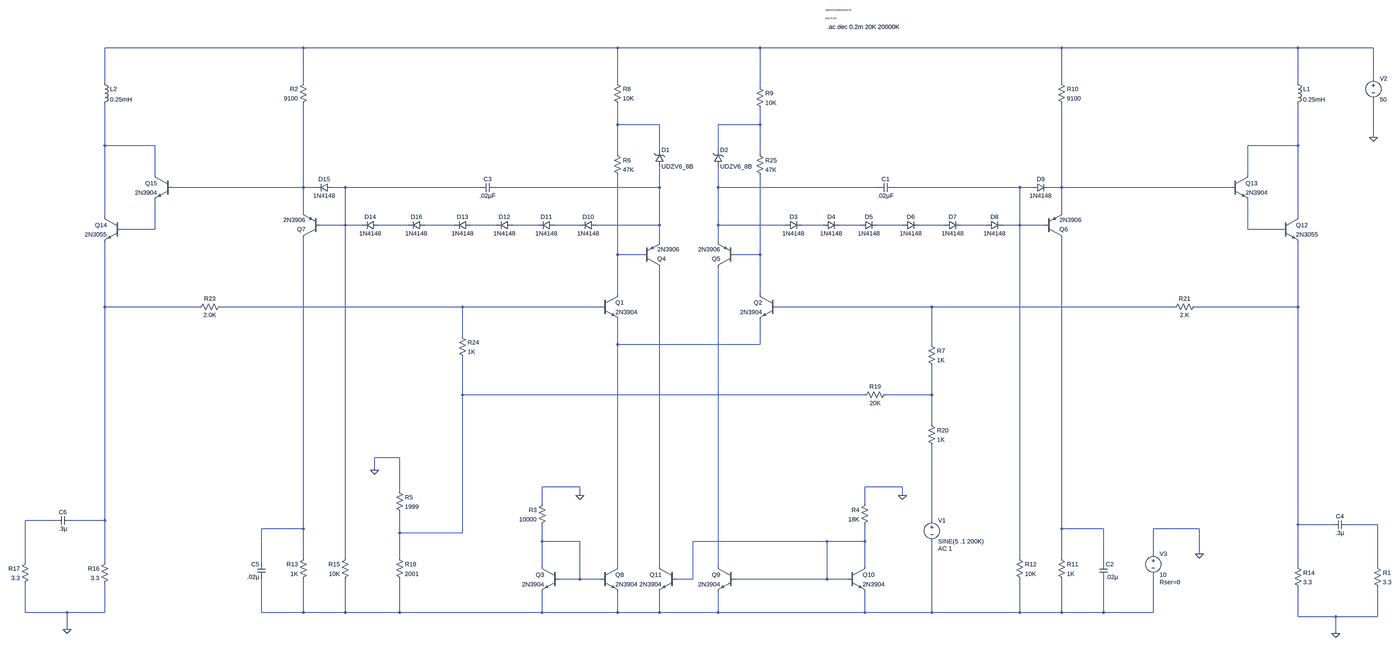
[diagram p0: schematic actestamp.asc, whole sheet]
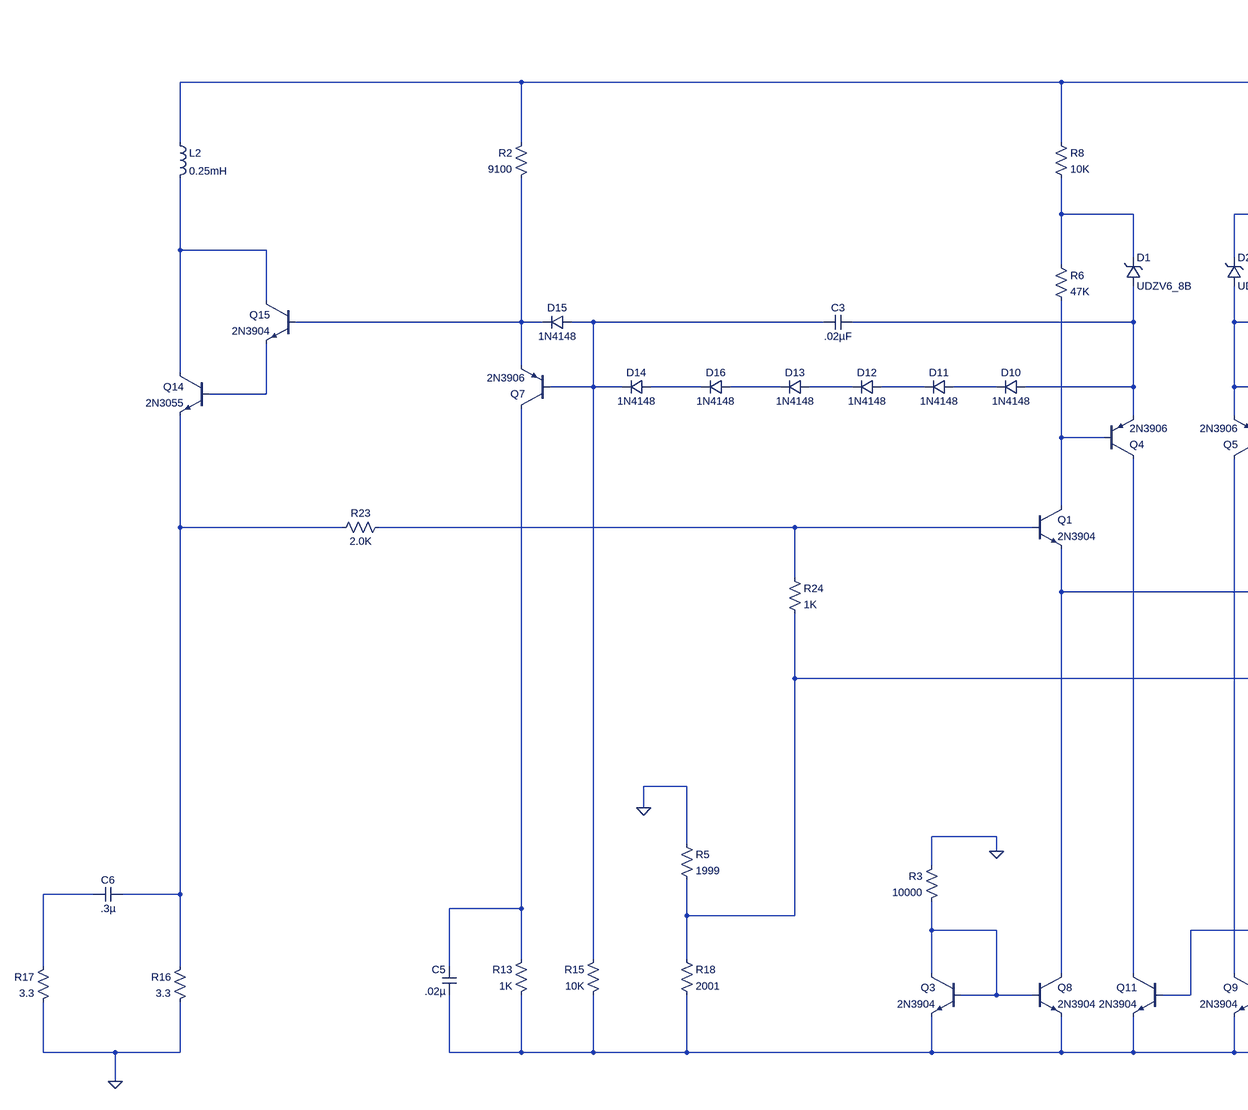
[diagram p1: schematic actestamp.asc, part, row 1 of 1, column 1 of 2]
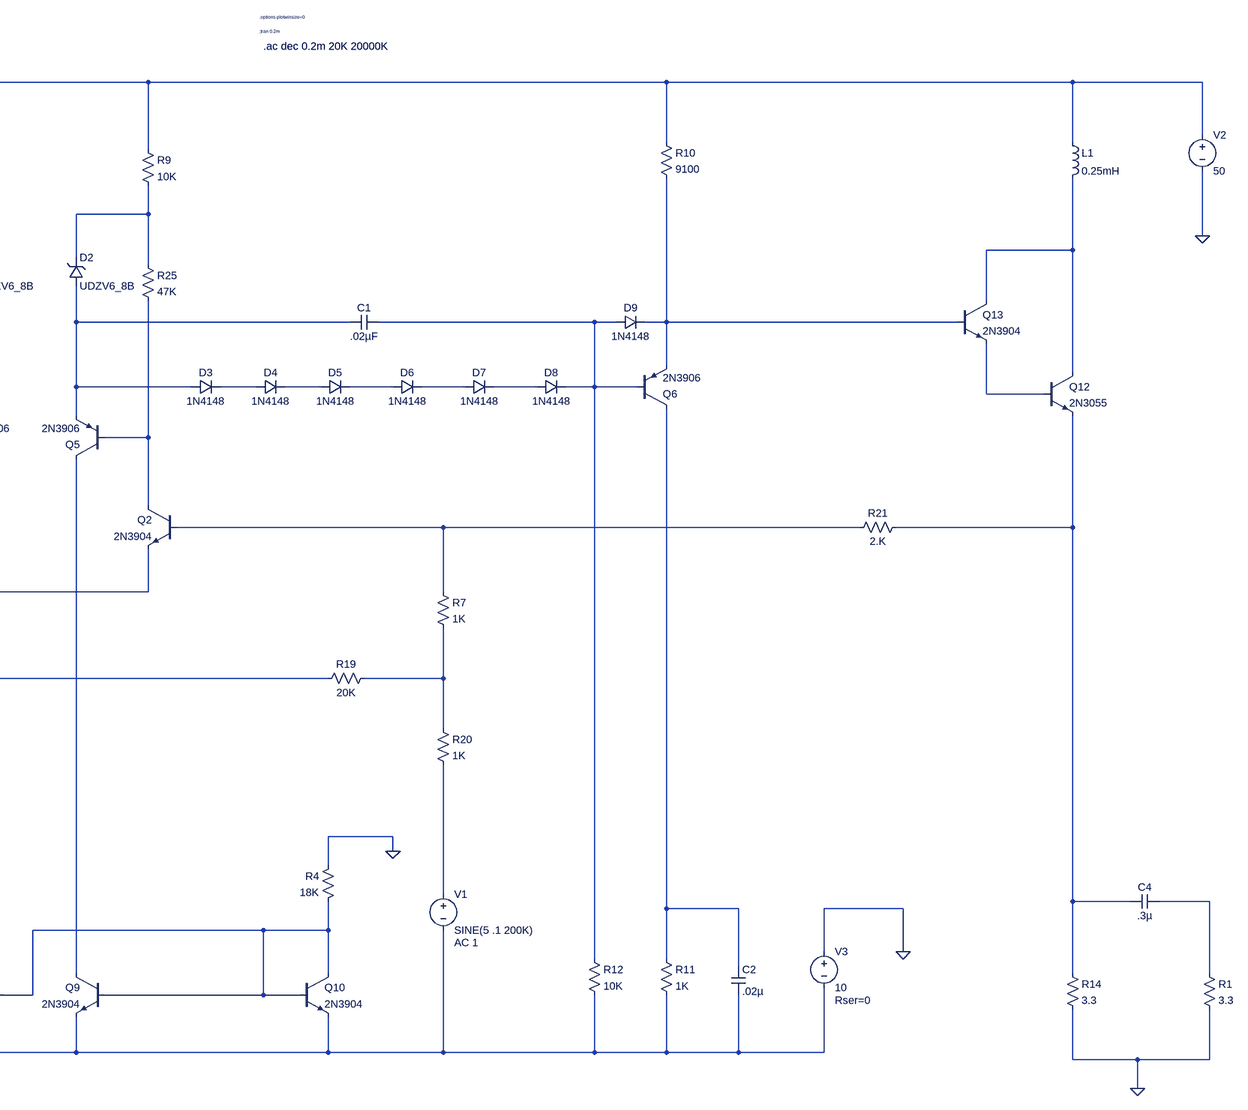
[diagram p2: schematic actestamp.asc, part, row 1 of 1, column 2 of 2]
actestamp.asc, the LTspice schematic file:
Version 4
SHEET 1 2560 2244
WIRE -1776 -1664 -2896 -1664
WIRE -576 -1664 -1776 -1664
WIRE -32 -1664 -576 -1664
WIRE 1120 -1664 -32 -1664
WIRE 2176 -1664 1120 -1664
WIRE 2464 -1664 2176 -1664
WIRE 2464 -1536 2464 -1664
WIRE -2896 -1520 -2896 -1664
WIRE -1776 -1520 -1776 -1664
WIRE -576 -1520 -576 -1664
WIRE 1120 -1520 1120 -1664
WIRE 2176 -1520 2176 -1664
WIRE -32 -1504 -32 -1664
WIRE -576 -1360 -576 -1440
WIRE -416 -1360 -576 -1360
WIRE -32 -1360 -32 -1424
WIRE -32 -1360 -192 -1360
WIRE 2464 -1312 2464 -1456
WIRE -2896 -1280 -2896 -1440
WIRE -2704 -1280 -2896 -1280
WIRE 2176 -1280 2176 -1440
WIRE 2176 -1280 1984 -1280
WIRE -416 -1264 -416 -1360
WIRE -192 -1264 -192 -1360
WIRE -576 -1248 -576 -1360
WIRE -32 -1248 -32 -1360
WIRE -2704 -1168 -2704 -1280
WIRE 1984 -1168 1984 -1280
WIRE -1776 -1120 -1776 -1440
WIRE -1776 -1120 -2640 -1120
WIRE -1728 -1120 -1776 -1120
WIRE -1616 -1120 -1664 -1120
WIRE -1104 -1120 -1616 -1120
WIRE -416 -1120 -416 -1200
WIRE -416 -1120 -1040 -1120
WIRE -192 -1120 -192 -1200
WIRE 416 -1120 -192 -1120
WIRE 960 -1120 480 -1120
WIRE 1008 -1120 960 -1120
WIRE 1120 -1120 1120 -1440
WIRE 1120 -1120 1072 -1120
WIRE 1920 -1120 1120 -1120
WIRE -1776 -1024 -1776 -1120
WIRE 1120 -1024 1120 -1120
WIRE -2896 -1008 -2896 -1280
WIRE 2176 -1008 2176 -1280
WIRE -1616 -976 -1616 -1120
WIRE -1616 -976 -1712 -976
WIRE -1552 -976 -1616 -976
WIRE -1376 -976 -1488 -976
WIRE -1200 -976 -1312 -976
WIRE -1040 -976 -1136 -976
WIRE -880 -976 -976 -976
WIRE -720 -976 -816 -976
WIRE -416 -976 -416 -1120
WIRE -416 -976 -656 -976
WIRE -192 -976 -192 -1120
WIRE 64 -976 -192 -976
WIRE 208 -976 128 -976
WIRE 352 -976 272 -976
WIRE 512 -976 416 -976
WIRE 672 -976 576 -976
WIRE 832 -976 736 -976
WIRE 960 -976 960 -1120
WIRE 960 -976 896 -976
WIRE 1056 -976 960 -976
WIRE -2704 -960 -2704 -1072
WIRE -2704 -960 -2832 -960
WIRE 1984 -960 1984 -1072
WIRE 2112 -960 1984 -960
WIRE -416 -912 -416 -976
WIRE -192 -912 -192 -976
WIRE -576 -864 -576 -1168
WIRE -480 -864 -576 -864
WIRE -32 -864 -32 -1168
WIRE -32 -864 -128 -864
WIRE -576 -592 -576 -864
WIRE -32 -592 -32 -864
WIRE -2896 -544 -2896 -912
WIRE -2528 -544 -2896 -544
WIRE -1168 -544 -2448 -544
WIRE -640 -544 -1168 -544
WIRE 624 -544 32 -544
WIRE 1680 -544 624 -544
WIRE 2176 -544 2176 -912
WIRE 2176 -544 1760 -544
WIRE -1168 -432 -1168 -544
WIRE -576 -400 -576 -496
WIRE -32 -400 -32 -496
WIRE -32 -400 -576 -400
WIRE 624 -400 624 -544
WIRE -1168 -208 -1168 -352
WIRE 368 -208 -1168 -208
WIRE 624 -208 624 -320
WIRE 624 -208 448 -208
WIRE 624 -96 624 -208
WIRE -1408 32 -1504 32
WIRE -1504 80 -1504 32
WIRE -720 144 -864 144
WIRE 512 144 368 144
WIRE -1408 160 -1408 32
WIRE -720 176 -720 144
WIRE 512 176 512 144
WIRE -864 208 -864 144
WIRE 368 208 368 144
WIRE -3088 272 -3200 272
WIRE -2896 272 -2896 -544
WIRE -2896 272 -3024 272
WIRE 624 272 624 -16
WIRE 2176 288 2176 -544
WIRE 2304 288 2176 288
WIRE 2480 288 2368 288
WIRE -1776 304 -1776 -928
WIRE -1776 304 -1936 304
WIRE 1120 304 1120 -928
WIRE 1280 304 1120 304
WIRE 1776 304 1600 304
WIRE -1408 320 -1408 240
WIRE -1168 320 -1168 -208
WIRE -1168 320 -1408 320
WIRE -864 352 -864 288
WIRE -720 352 -864 352
WIRE 224 352 -288 352
WIRE 368 352 368 288
WIRE 368 352 224 352
WIRE 1600 400 1600 304
WIRE 1776 400 1776 304
WIRE -1776 416 -1776 304
WIRE -1616 416 -1616 -976
WIRE -1408 416 -1408 320
WIRE 960 416 960 -976
WIRE 1120 416 1120 304
WIRE -3200 432 -3200 272
WIRE -2896 432 -2896 272
WIRE -1936 432 -1936 304
WIRE 1280 432 1280 304
WIRE -864 448 -864 352
WIRE -576 448 -576 -400
WIRE -416 448 -416 -816
WIRE -192 448 -192 -816
WIRE 368 448 368 352
WIRE 2176 448 2176 288
WIRE 2480 448 2480 288
WIRE -720 496 -720 352
WIRE -720 496 -800 496
WIRE -640 496 -720 496
WIRE -288 496 -288 352
WIRE -288 496 -352 496
WIRE 224 496 224 352
WIRE 224 496 -128 496
WIRE 304 496 224 496
WIRE -3200 624 -3200 512
WIRE -3040 624 -3200 624
WIRE -2896 624 -2896 512
WIRE -2896 624 -3040 624
WIRE -1936 624 -1936 496
WIRE -1776 624 -1776 496
WIRE -1776 624 -1936 624
WIRE -1616 624 -1616 496
WIRE -1616 624 -1776 624
WIRE -1408 624 -1408 496
WIRE -1408 624 -1616 624
WIRE -864 624 -864 544
WIRE -864 624 -1408 624
WIRE -576 624 -576 544
WIRE -576 624 -864 624
WIRE -416 624 -416 544
WIRE -416 624 -576 624
WIRE -192 624 -192 544
WIRE -192 624 -416 624
WIRE 368 624 368 544
WIRE 368 624 -192 624
WIRE 624 624 624 352
WIRE 624 624 368 624
WIRE 960 624 960 496
WIRE 960 624 624 624
WIRE 1120 624 1120 496
WIRE 1120 624 960 624
WIRE 1280 624 1280 496
WIRE 1280 624 1120 624
WIRE 1600 624 1600 480
WIRE 1600 624 1280 624
WIRE 2176 640 2176 528
WIRE 2320 640 2176 640
WIRE 2480 640 2480 528
WIRE 2480 640 2320 640
WIRE -3040 688 -3040 624
WIRE 2320 704 2320 640
FLAG 2320 704 0
FLAG 2464 -1312 0
FLAG -3040 688 0
FLAG 1776 400 0
FLAG -720 176 0
FLAG 512 176 0
FLAG -1504 80 0
DATAFLAG -576 -720 ""
DATAFLAG -32 -736 ""
DATAFLAG -928 -1120 ""
DATAFLAG 144 -1120 ""
DATAFLAG -1280 -1120 ""
DATAFLAG 672 -1120 ""
DATAFLAG -1008 624 ""
DATAFLAG 304 -1664 ""
DATAFLAG -128 -1296 ""
DATAFLAG -480 -1296 ""
DATAFLAG -224 -400 ""
DATAFLAG 176 -544 ""
DATAFLAG -912 -544 ""
DATAFLAG 1968 -544 ""
DATAFLAG -2720 -544 ""
DATAFLAG 1376 -1120 ""
DATAFLAG -2096 -1120 ""
DATAFLAG -480 -976 ""
SYMBOL npn -640 -592 R0
SYMATTR InstName Q1
SYMATTR Value 2N3904
SYMBOL npn 32 -592 M0
SYMATTR InstName Q2
SYMATTR Value 2N3904
SYMBOL pnp -480 -816 M180
SYMATTR InstName Q4
SYMATTR Value 2N3906
SYMBOL pnp -128 -816 R180
SYMATTR InstName Q5
SYMATTR Value 2N3906
SYMBOL res -592 -1264 R0
SYMATTR InstName R6
SYMATTR Value 47K
SYMBOL res 608 -416 R0
SYMATTR InstName R7
SYMATTR Value 1K
SYMBOL res -592 -1536 R0
SYMATTR InstName R8
SYMATTR Value 10K
SYMBOL res -48 -1520 R0
SYMATTR InstName R9
SYMATTR Value 10K
SYMBOL diode 64 -960 R270
WINDOW 0 32 32 VTop 2
WINDOW 3 0 32 VBottom 2
SYMATTR InstName D3
SYMATTR Value 1N4148
SYMBOL diode 208 -960 R270
WINDOW 0 32 32 VTop 2
WINDOW 3 0 32 VBottom 2
SYMATTR InstName D4
SYMATTR Value 1N4148
SYMBOL diode 352 -960 R270
WINDOW 0 32 32 VTop 2
WINDOW 3 0 32 VBottom 2
SYMATTR InstName D5
SYMATTR Value 1N4148
SYMBOL diode 512 -960 R270
WINDOW 0 32 32 VTop 2
WINDOW 3 0 32 VBottom 2
SYMATTR InstName D6
SYMATTR Value 1N4148
SYMBOL diode 672 -960 R270
WINDOW 0 32 32 VTop 2
WINDOW 3 0 32 VBottom 2
SYMATTR InstName D7
SYMATTR Value 1N4148
SYMBOL diode 832 -960 R270
WINDOW 0 32 32 VTop 2
WINDOW 3 0 32 VBottom 2
SYMATTR InstName D8
SYMATTR Value 1N4148
SYMBOL cap 480 -1136 R90
WINDOW 0 0 32 VBottom 2
WINDOW 3 32 32 VTop 2
SYMATTR InstName C1
SYMATTR Value .02µF
SYMBOL res 1104 -1536 R0
SYMATTR InstName R10
SYMATTR Value 9100
SYMBOL pnp 1056 -928 M180
SYMATTR InstName Q6
SYMATTR Value 2N3906
SYMBOL diode 1008 -1104 R270
WINDOW 0 32 32 VTop 2
WINDOW 3 0 32 VBottom 2
SYMATTR InstName D9
SYMATTR Value 1N4148
SYMBOL res 1104 400 R0
SYMATTR InstName R11
SYMATTR Value 1K
SYMBOL res 944 400 R0
SYMATTR InstName R12
SYMATTR Value 10K
SYMBOL cap 1264 432 R0
SYMATTR InstName C2
SYMATTR Value .02µ
SYMBOL res 2160 432 R0
SYMATTR InstName R14
SYMATTR Value 3.3
SYMBOL cap 2368 272 R90
WINDOW 0 0 32 VBottom 2
WINDOW 3 32 32 VTop 2
SYMATTR InstName C4
SYMATTR Value .3µ
SYMBOL res 2464 432 R0
SYMATTR InstName R1
SYMATTR Value 3.3
SYMBOL voltage 2464 -1552 R0
WINDOW 123 0 0 Left 2
WINDOW 39 0 0 Left 2
SYMATTR InstName V2
SYMATTR Value 50
SYMBOL diode -656 -960 M270
WINDOW 0 32 32 VTop 2
WINDOW 3 0 32 VBottom 2
SYMATTR InstName D10
SYMATTR Value 1N4148
SYMBOL diode -816 -960 M270
WINDOW 0 32 32 VTop 2
WINDOW 3 0 32 VBottom 2
SYMATTR InstName D11
SYMATTR Value 1N4148
SYMBOL diode -976 -960 M270
WINDOW 0 32 32 VTop 2
WINDOW 3 0 32 VBottom 2
SYMATTR InstName D12
SYMATTR Value 1N4148
SYMBOL diode -1136 -960 M270
WINDOW 0 32 32 VTop 2
WINDOW 3 0 32 VBottom 2
SYMATTR InstName D13
SYMATTR Value 1N4148
SYMBOL diode -1488 -960 M270
WINDOW 0 32 32 VTop 2
WINDOW 3 0 32 VBottom 2
SYMATTR InstName D14
SYMATTR Value 1N4148
SYMBOL cap -1104 -1136 M90
WINDOW 0 0 32 VBottom 2
WINDOW 3 32 32 VTop 2
SYMATTR InstName C3
SYMATTR Value .02µF
SYMBOL res -1760 -1536 M0
SYMATTR InstName R2
SYMATTR Value 9100
SYMBOL pnp -1712 -928 R180
SYMATTR InstName Q7
SYMATTR Value 2N3906
SYMBOL diode -1664 -1104 M270
WINDOW 0 32 32 VTop 2
WINDOW 3 0 32 VBottom 2
SYMATTR InstName D15
SYMATTR Value 1N4148
SYMBOL res -1760 400 M0
SYMATTR InstName R13
SYMATTR Value 1K
SYMBOL res -1600 400 M0
SYMATTR InstName R15
SYMATTR Value 10K
SYMBOL cap -1920 432 M0
SYMATTR InstName C5
SYMATTR Value .02µ
SYMBOL res -2880 416 M0
SYMATTR InstName R16
SYMATTR Value 3.3
SYMBOL cap -3088 256 M90
WINDOW 0 0 32 VBottom 2
WINDOW 3 32 32 VTop 2
SYMATTR InstName C6
SYMATTR Value .3µ
SYMBOL res -3184 416 M0
SYMATTR InstName R17
SYMATTR Value 3.3
SYMBOL res 1776 -560 R90
WINDOW 0 0 56 VBottom 2
WINDOW 3 32 56 VTop 2
SYMATTR InstName R21
SYMATTR Value 2.K
SYMBOL res -2432 -560 R90
WINDOW 0 0 56 VBottom 2
WINDOW 3 32 56 VTop 2
SYMATTR InstName R23
SYMATTR Value 2.0K
SYMBOL res -1184 -448 R0
SYMATTR InstName R24
SYMATTR Value 1K
SYMBOL res -48 -1264 R0
SYMATTR InstName R25
SYMATTR Value 47K
SYMBOL diode -1312 -960 M270
WINDOW 0 32 32 VTop 2
WINDOW 3 0 32 VBottom 2
SYMATTR InstName D16
SYMATTR Value 1N4148
SYMBOL zener -432 -1200 M180
WINDOW 0 24 64 Left 2
WINDOW 3 24 0 Left 2
SYMATTR InstName D1
SYMATTR Value UDZV6_8B
SYMBOL zener -208 -1200 M180
WINDOW 0 24 64 Left 2
WINDOW 3 24 0 Left 2
SYMATTR InstName D2
SYMATTR Value UDZV6_8B
SYMBOL voltage 1600 384 R0
WINDOW 123 0 0 Left 2
WINDOW 39 24 124 Left 2
SYMATTR SpiceLine Rser=0
SYMATTR InstName V3
SYMATTR Value 10
SYMBOL ind 2160 -1536 R0
SYMATTR InstName L1
SYMATTR Value 0.25mH
SYMATTR SpiceLine Ipk=1000 Rser=1 Rpar=680 Cpar=.00001uf
SYMBOL ind -2912 -1536 R0
SYMATTR InstName L2
SYMATTR Value 0.25mH
SYMATTR SpiceLine Ipk=1000 Rser=1 Rpar=680 Cpar=.00001uf
SYMBOL npn -800 448 M0
SYMATTR InstName Q3
SYMATTR Value 2N3904
SYMBOL npn -640 448 R0
SYMATTR InstName Q8
SYMATTR Value 2N3904
SYMBOL res -848 192 M0
SYMATTR InstName R3
SYMATTR Value 10000
SYMBOL npn -128 448 M0
SYMATTR InstName Q9
SYMATTR Value 2N3904
SYMBOL npn 304 448 R0
SYMATTR InstName Q10
SYMATTR Value 2N3904
SYMBOL res 384 192 M0
SYMATTR InstName R4
SYMATTR Value 18K
SYMBOL npn -352 448 M0
SYMATTR InstName Q11
SYMATTR Value 2N3904
SYMBOL res -1424 144 R0
SYMATTR InstName R5
SYMATTR Value 1999
SYMBOL res -1424 400 R0
SYMATTR InstName R18
SYMATTR Value 2001
SYMBOL res 464 -224 R90
WINDOW 0 0 56 VBottom 2
WINDOW 3 32 56 VTop 2
SYMATTR InstName R19
SYMATTR Value 20K
SYMBOL res 608 -112 R0
SYMATTR InstName R20
SYMATTR Value 1K
SYMBOL voltage 624 256 R0
WINDOW 123 24 124 Left 2
WINDOW 39 0 0 Left 2
SYMATTR InstName V1
SYMATTR Value SINE(5 .1 200K)
SYMATTR Value2 AC 1
SYMBOL npn 2112 -1008 R0
SYMATTR InstName Q12
SYMATTR Value 2N3055
SYMBOL npn 1920 -1168 R0
SYMATTR InstName Q13
SYMATTR Value 2N3904
SYMBOL npn -2832 -1008 M0
SYMATTR InstName Q14
SYMATTR Value 2N3055
SYMBOL npn -2640 -1168 M0
SYMATTR InstName Q15
SYMATTR Value 2N3904
TEXT 216 -1776 Left 0 !;tran 0.2m
TEXT 216 -1808 Left 0 !.options plotwinsize=0
TEXT 224 -1744 Left 2 !.ac dec 0.2m 20K 20000K

The netlist it stands for:
* actestamp.asc
Q1 N024 N027 N030 0 2N3904
Q2 N025 N028 N030 0 2N3904
Q4 N040 N024 N008 0 2N3906
Q5 N041 N025 N009 0 2N3906
R6 N002 N024 47K
R7 N028 N032 1K
R8 N001 N002 10K
R9 N001 N003 10K
D3 N009 N017 1N4148
D4 N017 N018 1N4148
D5 N018 N019 1N4148
D6 N019 N020 1N4148
D7 N020 N021 1N4148
D8 N021 N010 1N4148
C1 N010 N009 .02µF
R10 N001 N011 9100
Q6 N037 N010 N011 0 2N3906
D9 N010 N011 1N4148
R11 N037 N042 1K
R12 N010 N042 10K
C2 N037 N042 .02µ
R14 N029 0 3.3
C4 N035 N029 .3µ
R1 N035 0 3.3
V2 N001 0 50
D10 N008 N016 1N4148
D11 N016 N015 1N4148
D12 N015 N014 1N4148
D13 N014 N013 1N4148
D14 N012 N007 1N4148
C3 N007 N008 .02µF
R2 N001 N006 9100
Q7 N036 N007 N006 0 2N3906
D15 N007 N006 1N4148
R13 N036 N042 1K
R15 N007 N042 10K
C5 N036 N042 .02µ
R16 N026 0 3.3
C6 N033 N026 .3µ
R17 N033 0 3.3
R21 N029 N028 2.K
R23 N027 N026 2.0K
R24 N027 N031 1K
R25 N003 N025 47K
D16 N013 N012 1N4148
D1 N008 N002 UDZV6_8B
D2 N009 N003 UDZV6_8B
V3 0 N042 10 Rser=0
L1 N001 N005 0.25mH Ipk=1000 Rser=1 Rpar=680 Cpar=.00001uf
L2 N001 N004 0.25mH Ipk=1000 Rser=1 Rpar=680 Cpar=.00001uf
Q3 N038 N038 N042 0 2N3904
Q8 N030 N038 N042 0 2N3904
R3 0 N038 10000
Q9 N041 N039 N042 0 2N3904
Q10 N039 N039 N042 0 2N3904
R4 0 N039 18K
Q11 N040 N039 N042 0 2N3904
R5 0 N031 1999
R18 N031 N042 2001
R19 N032 N031 20K
R20 N032 N034 1K
V1 N034 N042 SINE(5 .1 200K) AC 1
Q12 N005 N023 N029 0 2N3055
Q13 N005 N011 N023 0 2N3904
Q14 N004 N022 N026 0 2N3055
Q15 N004 N006 N022 0 2N3904
.model D D
.lib standard.dio
.model NPN NPN
.model PNP PNP
.lib standard.bjt
;tran 0.2m
.options plotwinsize=0
.ac dec 0.2m 20K 20000K
.backanno
.end